# EAGLE design Skaarhoj BI8-2x4RGB (EAGLE 6.2)

## Sheet 1 of 2
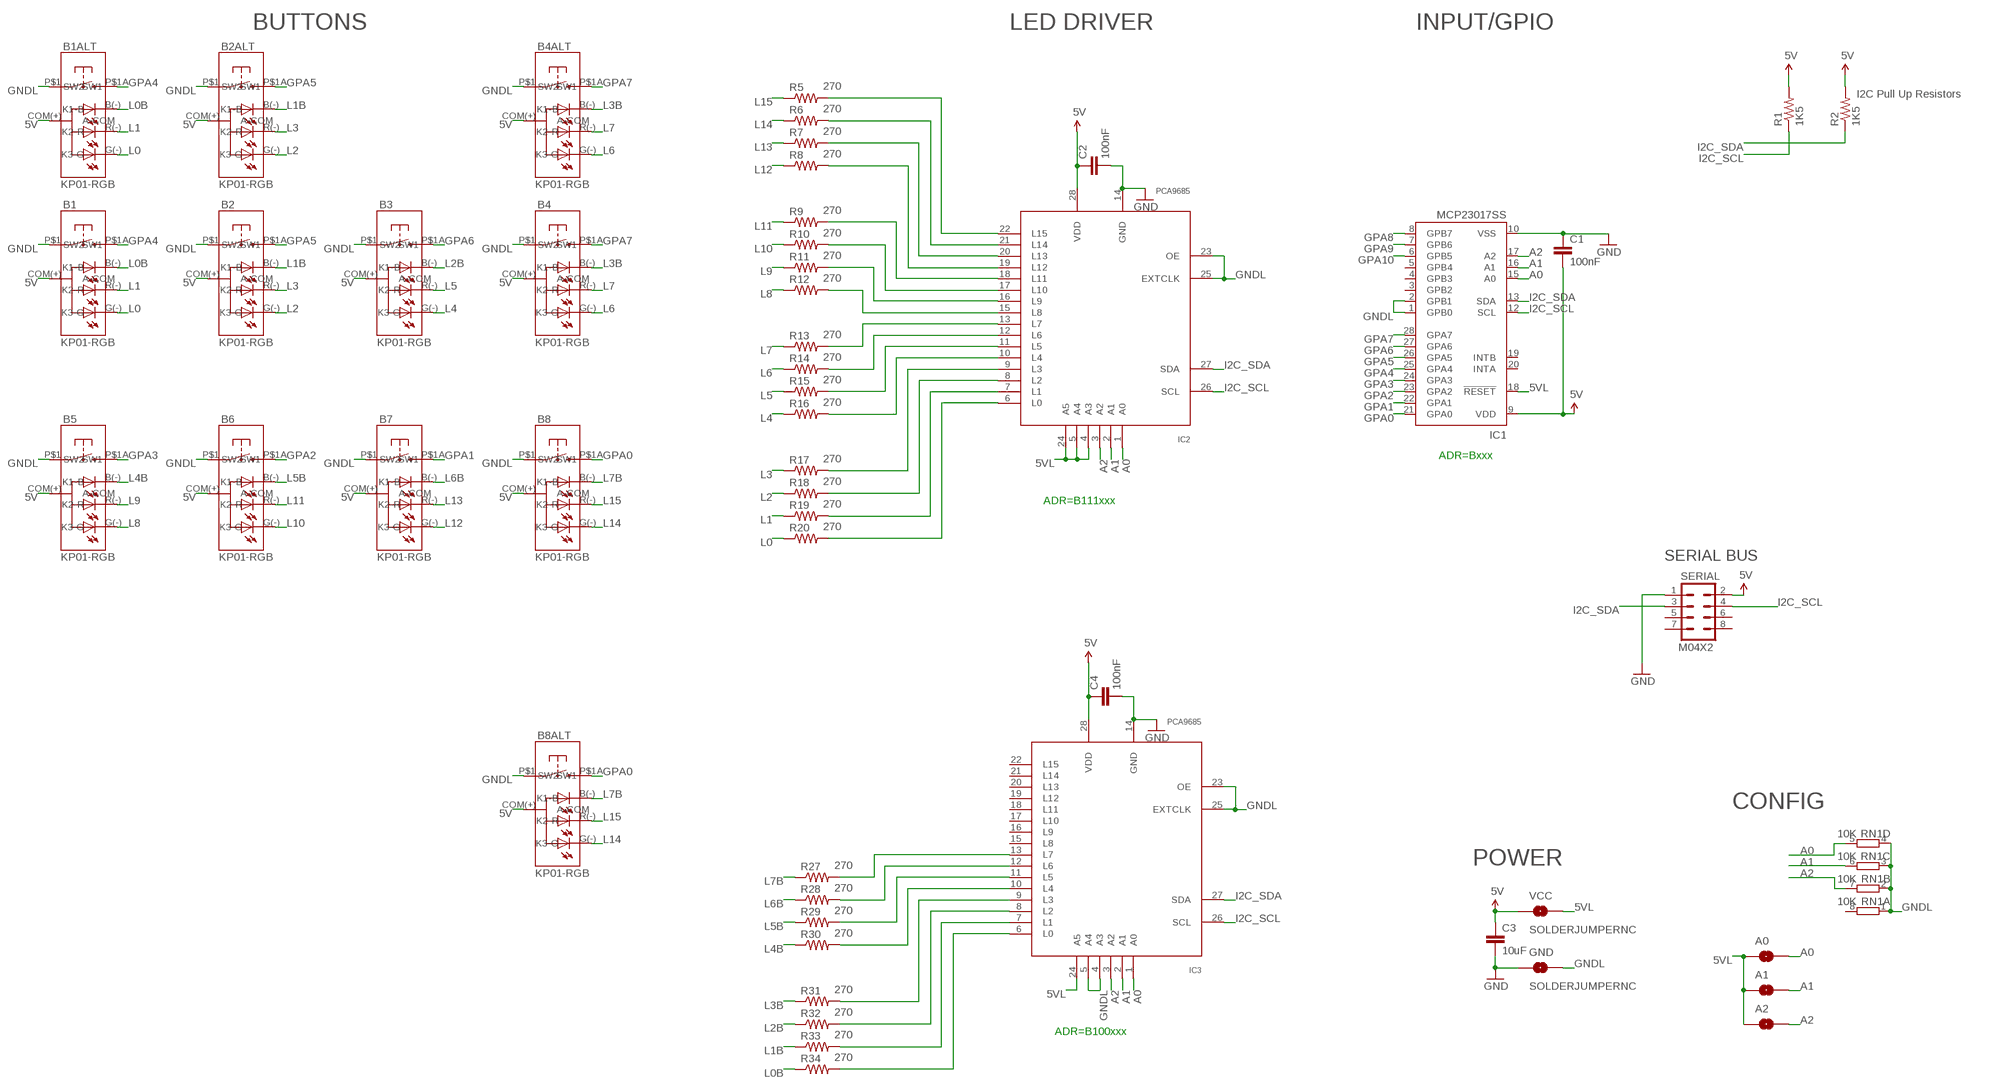
[diagram p0: schematic, sheet 1]

### Parts
A0  SOLDERJUMPERNC  [SJ_2S]
A1  SOLDERJUMPERNC  [SJ_2S]
A2  SOLDERJUMPERNC  [SJ_2S]
B1  KP01-RGB  NKK-KP01  [NKK-KP01]
B1ALT  KP01-RGB  NKK-KP01  [NKK-KP01]
B2  KP01-RGB  NKK-KP01  [NKK-KP01]
B2ALT  KP01-RGB  NKK-KP01  [NKK-KP01]
B3  KP01-RGB  NKK-KP01  [NKK-KP01]
B4  KP01-RGB  NKK-KP01  [NKK-KP01]
B4ALT  KP01-RGB  NKK-KP01  [NKK-KP01]
B5  KP01-RGB  NKK-KP01  [NKK-KP01]
B6  KP01-RGB  NKK-KP01  [NKK-KP01]
B7  KP01-RGB  NKK-KP01  [NKK-KP01]
B8  KP01-RGB  NKK-KP01  [NKK-KP01]
B8ALT  KP01-RGB  NKK-KP01  [NKK-KP01]
C1  100nF  CAP0603-CAP  [0603-CAP]
C2  100nF  CAP0603-CAP  [0603-CAP]
C3  10uF  CAP0805  [0805]
C4  100nF  CAP0603-CAP  [0603-CAP]
GND  SOLDERJUMPERNC  [SJ_2S]
IC1  MCP23017SS  [SSOP28]
IC2  PCA9685  [TSSOP28]
IC3  PCA9685  [TSSOP28]
R1  1K5  RESISTOR0603-RES  [0603-RES]
R2  1K5  RESISTOR0603-RES  [0603-RES]
R5  270  RESISTOR0603-RES  [0603-RES]
R6  270  RESISTOR0603-RES  [0603-RES]
R7  270  RESISTOR0603-RES  [0603-RES]
R8  270  RESISTOR0603-RES  [0603-RES]
R9  270  RESISTOR0603-RES  [0603-RES]
R10  270  RESISTOR0603-RES  [0603-RES]
R11  270  RESISTOR0603-RES  [0603-RES]
R12  270  RESISTOR0603-RES  [0603-RES]
R13  270  RESISTOR0603-RES  [0603-RES]
R14  270  RESISTOR0603-RES  [0603-RES]
R15  270  RESISTOR0603-RES  [0603-RES]
R16  270  RESISTOR0603-RES  [0603-RES]
R17  270  RESISTOR0603-RES  [0603-RES]
R18  270  RESISTOR0603-RES  [0603-RES]
R19  270  RESISTOR0603-RES  [0603-RES]
R20  270  RESISTOR0603-RES  [0603-RES]
R27  270  RESISTOR0603-RES  [0603-RES]
R28  270  RESISTOR0603-RES  [0603-RES]
R29  270  RESISTOR0603-RES  [0603-RES]
R30  270  RESISTOR0603-RES  [0603-RES]
R31  270  RESISTOR0603-RES  [0603-RES]
R32  270  RESISTOR0603-RES  [0603-RES]
R33  270  RESISTOR0603-RES  [0603-RES]
R34  270  RESISTOR0603-RES  [0603-RES]
RN1  10K  4R-NCAY16  [CAY16_HAND]
SERIAL  M04X2  [2X4]
VCC  SOLDERJUMPERNC  [SJ_2S]

### Nets
5V [Power]: B1.COM(+)(A-COM) B1ALT.COM(+)(A-COM) B2.COM(+)(A-COM) B2ALT.COM(+)(A-COM) B3.COM(+)(A-COM) B4.COM(+)(A-COM) B4ALT.COM(+)(A-COM) B5.COM(+)(A-COM) B6.COM(+)(A-COM) B7.COM(+)(A-COM) B8.COM(+)(A-COM) B8ALT.COM(+)(A-COM) C1.2 C2.1 C3.1 C4.1 IC1.9(VDD) IC2.28(VDD) IC3.28(VDD) R1.2 R2.2 SERIAL.2 VCC.1
5VL: A0.1 A1.1 A2.1 IC1.18(!RESET) IC2.4(A3) IC2.5(A4) IC2.24(A5) IC3.24(A5) VCC.2
A0: A0.2 IC1.15(A0) IC2.1(A0) IC3.1(A0) RN1.5
A1: A1.2 IC1.16(A1) IC2.2(A1) IC3.2(A1) RN1.6
A2: A2.2 IC1.17(A2) IC2.3(A2) IC3.3(A2) RN1.7
GND [Power]: C1.1 C2.2 C3.2 C4.2 GND.1 IC1.10(VSS) IC2.14(GND) IC3.14(GND) SERIAL.1
GNDL: B1.P$1(SW1) B1ALT.P$1(SW1) B2.P$1(SW1) B2ALT.P$1(SW1) B3.P$1(SW1) B4.P$1(SW1) B4ALT.P$1(SW1) B5.P$1(SW1) B6.P$1(SW1) B7.P$1(SW1) B8.P$1(SW1) B8ALT.P$1(SW1) GND.2 IC1.1(GPB0) IC1.2(GPB1) IC2.23(OE) IC2.25(EXTCLK) IC3.4(A3) IC3.5(A4) IC3.23(OE) IC3.25(EXTCLK) RN1.1 RN1.2 RN1.3 RN1.4
GPA0: B8.P$1A(SW2) B8ALT.P$1A(SW2) IC1.21(GPA0)
GPA1: B7.P$1A(SW2) IC1.22(GPA1)
GPA2: B6.P$1A(SW2) IC1.23(GPA2)
GPA3: B5.P$1A(SW2) IC1.24(GPA3)
GPA4: B1.P$1A(SW2) B1ALT.P$1A(SW2) IC1.25(GPA4)
GPA5: B2.P$1A(SW2) B2ALT.P$1A(SW2) IC1.26(GPA5)
GPA6: B3.P$1A(SW2) IC1.27(GPA6)
GPA7: B4.P$1A(SW2) B4ALT.P$1A(SW2) IC1.28(GPA7)
GPA8: IC1.8(GPB7)
GPA9: IC1.7(GPB6)
GPA10: IC1.6(GPB5)
I2C_SCL: IC1.12(SCL) IC2.26(SCL) IC3.26(SCL) R1.1 SERIAL.4
I2C_SDA: IC1.13(SDA) IC2.27(SDA) IC3.27(SDA) R2.1 SERIAL.3
L0: B1.G(-)(K3-G) B1ALT.G(-)(K3-G) R20.1
L0B: B1.B(-)(K1-B) B1ALT.B(-)(K1-B) R34.1
L1: B1.R(-)(K2-R) B1ALT.R(-)(K2-R) R19.1
L1B: B2.B(-)(K1-B) B2ALT.B(-)(K1-B) R33.1
L2: B2.G(-)(K3-G) B2ALT.G(-)(K3-G) R18.1
L2B: B3.B(-)(K1-B) R32.1
L3: B2.R(-)(K2-R) B2ALT.R(-)(K2-R) R17.1
L3B: B4.B(-)(K1-B) B4ALT.B(-)(K1-B) R31.1
L4: B3.G(-)(K3-G) R16.1
L4B: B5.B(-)(K1-B) R30.1
L5: B3.R(-)(K2-R) R15.1
L5B: B6.B(-)(K1-B) R29.1
L6: B4.G(-)(K3-G) B4ALT.G(-)(K3-G) R14.1
L6B: B7.B(-)(K1-B) R28.1
L7: B4.R(-)(K2-R) B4ALT.R(-)(K2-R) R13.1
L7B: B8.B(-)(K1-B) B8ALT.B(-)(K1-B) R27.1
L8: B5.G(-)(K3-G) R12.1
L9: B5.R(-)(K2-R) R11.1
L10: B6.G(-)(K3-G) R10.1
L11: B6.R(-)(K2-R) R9.1
L12: B7.G(-)(K3-G) R8.1
L13: B7.R(-)(K2-R) R7.1
L14: B8.G(-)(K3-G) B8ALT.G(-)(K3-G) R6.1
L15: B8.R(-)(K2-R) B8ALT.R(-)(K2-R) R5.1
N$2: IC3.13(L7) R27.2
N$3: IC3.12(L6) R28.2
N$4: IC2.13(L7) R13.2
N$5: IC2.12(L6) R14.2
N$6: IC3.11(L5) R29.2
N$7: IC2.11(L5) R15.2
N$9: IC2.10(L4) R16.2
N$10: IC2.9(L3) R17.2
N$11: IC2.8(L2) R18.2
N$12: IC2.7(L1) R19.2
N$13: IC3.10(L4) R30.2
N$14: IC3.9(L3) R31.2
N$15: IC3.8(L2) R32.2
N$16: IC3.7(L1) R33.2
N$17: IC3.6(L0) R34.2
N$19: IC2.6(L0) R20.2
N$20: IC2.15(L8) R12.2
N$21: IC2.16(L9) R11.2
N$22: IC2.17(L10) R10.2
N$23: IC2.18(L11) R9.2
N$24: IC2.19(L12) R8.2
N$25: IC2.20(L13) R7.2
N$26: IC2.21(L14) R6.2
N$27: IC2.22(L15) R5.2
Unconnected: IC1.3(GPB2) IC1.4(GPB3) IC1.5(GPB4) IC1.19(INTB) IC1.20(INTA) IC3.15(L8) IC3.16(L9) IC3.17(L10) IC3.18(L11) IC3.19(L12) IC3.20(L13) IC3.21(L14) IC3.22(L15) RN1.8 SERIAL.5 SERIAL.6 SERIAL.7 SERIAL.8

### Notes on the sheet
- BUTTONS | LED DRIVER | INPUT/GPIO
- I2C Pull Up Resistors
- ADR=Bxxx
- ADR=B111xxx
- SERIAL BUS
- CONFIG
- POWER
- ADR=B100xxx

## Sheet 2 of 2

## Library data of the parts
A0 A1 A2 GND VCC = SparkFun:SOLDERJUMPER: Solder Jumper Standard SMD solder jumper. Used to automate production. Two varients : Normally Open and Normally Closed are the same, but have different paste layers. NC will have a large amount of paste and should jumper during reflow.
B1 B1ALT B2 B2ALT B3 B4 B4ALT B5-B8 B8ALT = SKAARHOJ:NKK-KP01: NKK-KP01-15AC 100mA12VDC
C1-C4 = SparkFun:CAP: Capacitor Standard 0603 ceramic capacitor, and 0.1" leaded capacitor.
IC1 = microchip:MCP23017: http://ww1.microchip.com/downloads/en/DeviceDoc/21952a.pdf Source: http://ww1.microchip.com/downloads/en/DeviceDoc/21952a.pdf; MF: MICROCHIP; MPN: MCP23017-E/SS; OC_FARNELL: 1467674; OC_NEWARK: 31K2960
IC2 IC3 = wsmith:PCA9685
R1 R2 R5-R20 R27-R34 = SparkFun:RESISTOR: Resistor Basic schematic elements and footprints for 0603, 1206, and PTH resistors.
RN1 = SKAARHOJ:4R-N: Array Chip Resistor Source: RS Component / Phycomp; OC_FARNELL: unknown; OC_NEWARK: unknown
SERIAL = SparkFun:M04X2

## Net classes
0 default: width 0.152 mm, drill 0.254 mm, clearance 0.152 mm
1 Power: width 0.406 mm, drill 0.61 mm, clearance 0.203 mm

## Board
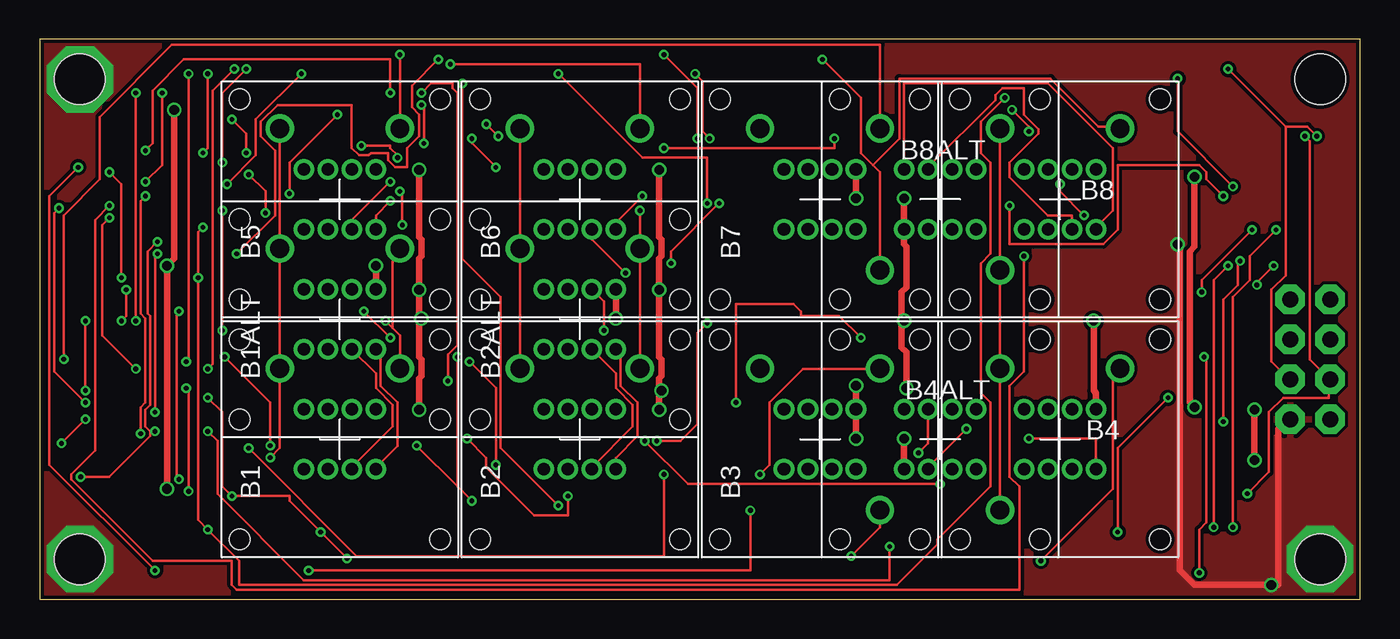
[diagram p1: board, top side]
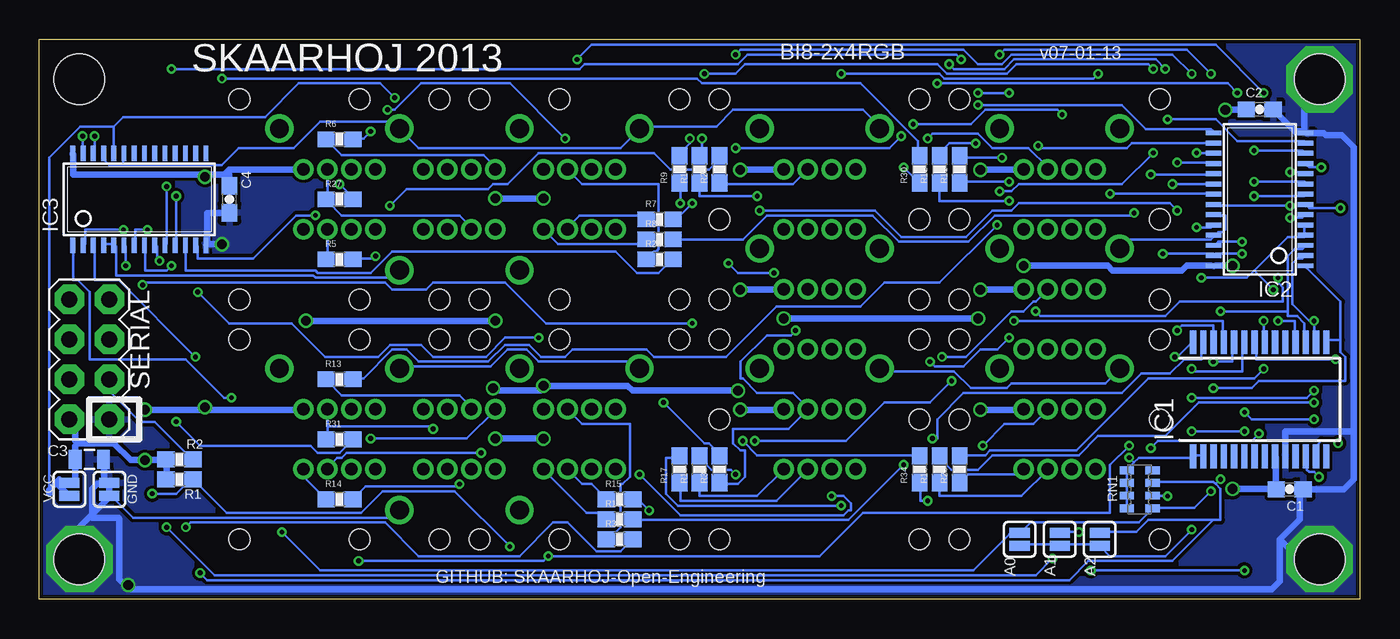
[diagram p2: board, bottom side, seen from below]

Size 83.82 x 35.56 mm. Coordinates in mm from the lower left corner, seen from the top.
Outline: 0,0 83.82,0 83.82,35.56 0,35.56 0,0
Copper layers (1*16): Top 0.035mm / dielectric 1.5mm / Bottom 0.035mm
Design rules: minimum track width 6mil, minimum drill 12mil, track to track 6mil, track to pad 6mil, pad to pad 6mil, via to via 6mil, smd to smd 0mil, copper to edge 10mil, drill to drill 10mil, minimum pad ring 10mil, minimum via ring 6mil, stop-mask expansion 2mil, vias tented up to drill 100mil, thermal gap 10mil
Holes 3.2 mm at 2.54,2.54 2.54,33.02 81.28,33.02 81.28,2.54

### Footprints (pad centres in the part's own frame; a part is rotated, then mirrored left to right if it is on the bottom)
SJ_2S = smd 0.635 x 1.27: 1 -0.412,0; 2 0.412,0
NKK-KP01 = drill 0.8: B(-) 1.905,-0.762; COM(+) 1.905,-2.286; G(-) -1.905,-2.286; P$3 1.905,0.762; P$4 1.905,2.286; P$7 -1.905,0.762; P$8 -1.905,2.286; R(-) -1.905,-0.762 | drill 1.2: P$1 4.496,3.81; P$1A 4.496,-3.81 | hole 1.3: -6.35,6.35; 6.35,6.35; 6.35,-6.35; -6.35,-6.35
0603-CAP = smd 1.1 x 1: 1 -0.85,0; 2 0.85,0
0805 = smd 0.8 x 1.2: 1 -0.9,0; 2 0.9,0
SSOP28 = smd 0.4 x 1.5: 1 -4.225,-3.625; 2 -3.575,-3.625; 3 -2.925,-3.625; 4 -2.275,-3.625; 5 -1.625,-3.625; 6 -0.975,-3.625; 7 -0.325,-3.625; 8 0.325,-3.625; 9 0.975,-3.625; 10 1.625,-3.625; 11 2.275,-3.625; 12 2.925,-3.625; 13 3.575,-3.625; 14 4.225,-3.625; 15 4.225,3.625; 16 3.575,3.625; 17 2.925,3.625; 18 2.275,3.625; 19 1.625,3.625; 20 0.975,3.625; 21 0.325,3.625; 22 -0.325,3.625; 23 -0.975,3.625; 24 -1.625,3.625; 25 -2.275,3.625; 26 -2.925,3.625; 27 -3.575,3.625; 28 -4.225,3.625
TSSOP28 = smd 0.305 x 0.991: 1 -4.225,-2.918; 2 -3.575,-2.918; 3 -2.925,-2.918; 4 -2.275,-2.918; 5 -1.625,-2.918; 6 -0.975,-2.918; 7 -0.325,-2.918; 8 0.325,-2.918; 9 0.975,-2.918; 10 1.625,-2.918; 11 2.275,-2.918; 12 2.925,-2.918; 13 3.575,-2.918; 14 4.225,-2.918; 15 4.225,2.918; 16 3.575,2.918; 17 2.925,2.918; 18 2.275,2.918; 19 1.625,2.918; 20 0.975,2.918; 21 0.325,2.918; 22 -0.325,2.918; 23 -0.975,2.918; 24 -1.625,2.918; 25 -2.275,2.918; 26 -2.925,2.918; 27 -3.575,2.918; 28 -4.225,2.918
0603-RES = smd 1.1 x 1: 1 -0.85,0; 2 0.85,0
CAY16_HAND = smd 0.5 x 0.904: 1 -1.2,-0.813; 2 -0.4,-0.813; 3 0.4,-0.813; 4 1.2,-0.813; 5 1.2,0.813; 6 0.4,0.813; 7 -0.4,0.813; 8 -1.2,0.813
2X4 = drill 1.016 pad 1.88 octagon: 1 -3.81,-1.27; 2 -3.81,1.27; 3 -1.27,-1.27; 4 -1.27,1.27; 5 1.27,-1.27; 6 1.27,1.27; 7 3.81,-1.27; 8 3.81,1.27

### Placement (x,y rotation side)
A0  21.59,3.81 90 bottom
A1  19.05,3.81 90 bottom
A2  16.51,3.81 90 bottom
B1  19.05,10.16 90 top
B1ALT  19.05,17.78 90 top
B2  34.29,10.16 90 top
B2ALT  34.29,17.78 90 top
B3  49.53,10.16 90 top
B4  64.77,10.16 90 top
B4ALT  57.15,10.16 270 top
B5  19.05,25.4 90 top
B6  34.29,25.4 90 top
B7  49.53,25.4 90 top
B8  64.77,25.4 90 top
B8ALT  57.15,25.4 270 top
C1  4.45,6.99 180 bottom
C2  6.35,31.11 0 bottom
C3  80.64,8.89 0 bottom
C4  71.75,25.4 270 bottom
GND  79.38,6.99 270 bottom
IC1  6.35,12.7 0 bottom
IC2  6.35,25.4 90 bottom
IC3  77.47,25.4 0 bottom
R1  74.93,7.62 180 bottom
R2  74.93,8.89 180 bottom
R5  64.77,21.59 0 bottom
R6  64.77,29.21 0 bottom
R7  44.45,24.13 0 bottom
R8  44.45,22.86 0 bottom
R9  43.18,27.3 90 bottom
R10  41.91,27.3 90 bottom
R11  25.4,27.3 90 bottom
R12  26.67,27.3 90 bottom
R13  64.77,13.97 0 bottom
R14  64.77,6.35 0 bottom
R15  46.99,6.35 0 bottom
R16  46.99,5.08 0 bottom
R17  43.18,8.26 90 bottom
R18  41.91,8.26 90 bottom
R19  26.67,8.26 90 bottom
R20  25.4,8.26 90 bottom
R27  64.77,25.4 0 bottom
R28  44.45,21.59 0 bottom
R29  40.64,27.3 90 bottom
R30  27.94,27.3 90 bottom
R31  64.77,10.16 0 bottom
R32  46.99,3.81 0 bottom
R33  40.64,8.26 90 bottom
R34  27.94,8.26 90 bottom
RN1  13.97,6.99 270 bottom
SERIAL  80.64,15.24 90 bottom
VCC  81.92,6.99 270 bottom

### Tracks (layer width: path | path; a pad name or v marks a point on that pad's centre or on a via)
5V  (via drill 0.61)
  Top 0.406: v24.08,12.04 24.08,14.02 24.23,14.17 24.23,15.24 24.08,15.39 24.08,17.83 | 24.08,17.83 v24.08,19.66 24.08,21.64 24.23,21.79 24.23,22.86 24.08,23.01 v24.08,27.28 | v8.53,31.09 8.53,21.64 v8.08,21.18 v8.08,7.01 | v21.34,21.18 B1ALT.COM(+) | v77.11,8.84 v77.11,12.04 | v73.3,26.82 73.3,22.4 73,22.1 73,12.5 v73.3,12.19 | v54.86,25.45 B8ALT.COM(+) 54.86,22.55 55.02,22.4 55.02,19.81 54.71,19.51 54.71,17.68 | B7.COM(+) v51.82,25.45 | v54.86,10.21 B4ALT.COM(+) | v51.82,10.21 B3.COM(+) v51.82,13.56 | 39.32,13.26 39.32,14.02 39.47,14.17 39.47,15.24 39.32,15.39 v39.32,19.66 39.32,21.64 39.47,21.79 39.47,22.86 39.32,23.01 v39.32,27.28 | 39.32,13.26 v39.32,12.04 | v39.47,13.26 39.32,13.26 | 54.71,17.68 54.71,16 55.02,15.7 v55.02,13.41 | B4.COM(+) 67.06,13.11 66.9,13.26 v66.9,17.68 | v54.86,17.68 54.71,17.68 | B2ALT.COM(+) v36.58,17.83 | v24.23,17.83 24.08,17.83
  Bottom 0.406: v24.08,12.04 21.34,12.04 B1.COM(+) | v24.08,19.66 21.34,19.66 B1ALT.COM(+) | v24.08,27.28 21.34,27.28 B5.COM(+) | IC1.9 5.33,8.99 5.33,7.01 C1.2 5.49,7.01 v8.08,7.01 | v8.08,21.18 9.14,21.18 IC2.28 9.45,21.18 10.97,21.18 11.28,20.88 15.7,20.88 16,21.18 v21.34,21.18 | v8.53,31.09 7.32,31.09 C2.1 | 71.93,26.98 71.78,26.98 71.78,26.36 C4.1 | 71.93,26.98 73.3,26.98 | 73.3,26.98 81.69,26.98 81.69,28.19 IC3.28 | B8.COM(+) 67.06,27.28 71.78,27.28 71.93,27.13 71.93,26.98 | R1.2 75.74,7.62 75.74,8.84 R2.2 75.89,8.84 v77.11,8.84 78.03,8.84 79.1,9.91 81.38,9.91 | VCC.1 81.84,7.47 81.53,7.47 81.53,8.84 C3.1 81.53,8.99 81.53,9.75 81.38,9.91 | v77.11,12.04 73.3,12.04 | 73.3,12.04 67.06,12.04 B4.COM(+) | SERIAL.2 81.84,11.43 81.53,11.12 81.53,10.06 81.38,10.06 81.38,9.91 | v73.3,26.82 73.3,26.98 | v73.3,12.19 73.3,12.04 | v51.82,25.45 v54.86,25.45 | v51.82,10.21 v54.86,10.21 | v39.32,12.04 36.58,12.04 B2.COM(+) | v39.32,19.66 36.58,19.66 B2ALT.COM(+) | v39.32,27.28 36.58,27.28 B6.COM(+) | v39.47,13.26 46.18,13.26 46.48,13.56 v51.82,13.56 51.82,13.41 51.97,13.26 54.86,13.26 v55.02,13.41 | v54.86,17.68 v66.9,17.68 | v36.58,17.83 v24.23,17.83
5VL  (via drill 0.3)
  Top 0.152: v10.36,23.62 10.06,23.32 v10.06,20.42 10.06,5.03 v10.67,4.42 12.65,2.44 12.65,0.91 54.41,0.91 57,3.5 57,3.81 60.35,7.16 60.35,12.5 59.74,13.11 59.74,21.34 60.35,21.95 60.35,27.74 59.74,28.35 59.74,30.33 v61.27,31.85 | v5.18,17.68 5.49,17.98 v5.49,19.66
  Bottom 0.152: 79.1,30.02 79.1,28.35 IC3.24 | 79.1,30.02 81.23,30.02 83.21,28.04 83.21,6.71 | 81.99,6.71 VCC.2 | 19.05,3.5 16.61,3.5 A2.1 16.46,3.35 15.85,2.74 12.34,2.74 v10.67,4.42 | 19.05,3.5 21.49,3.5 A0.1 | 19.05,3.5 A1.1 | IC2.5 3.5,23.77 3.5,23.16 IC2.4 3.5,23.01 4.57,23.01 6.71,20.88 | v10.36,23.62 9.45,23.62 9.3,23.77 IC2.24 | v10.06,20.42 7.16,20.42 6.71,20.88 | v5.18,17.68 4.12,17.68 4.12,16.46 IC1.18 | 6.71,20.88 v5.49,19.66 | 79.1,30.02 78.49,30.63 69.49,30.63 67.36,32.77 62.18,32.77 v61.27,31.85
  Bottom 0.406: 83.21,6.71 83.21,6.96 82.55,7.62 82.55,7.21 VCC.2
A0  (via drill 0.3)
  Top 0.152: v71.63,12.8 68.43,9.6 v68.43,4.27 | v9.3,13.41 9.45,13.26 v9.45,6.86
  Bottom 0.152: 1.22,16.46 1.22,18.9 3.35,21.03 IC2.1 | 1.22,16.46 1.98,16.46 IC1.15 | v71.63,12.8 72.08,12.8 74.52,15.24 80.62,15.24 80.62,19.51 81.38,20.27 81.69,20.27 81.69,22.4 IC3.1 | v68.43,4.27 65.99,1.83 24.54,1.83 22.25,4.12 21.64,4.12 A0.2 21.49,4.27 20.88,4.88 14.02,4.88 13.26,5.64 RN1.5 13.11,5.79 10.52,5.79 v9.45,6.86 | 1.22,16.46 1.22,15.7 0.91,15.39 0.91,13.87 6.4,13.87 6.86,13.41 v9.3,13.41
A1  (via drill 0.3)
  Top 0.152: v78.49,23.47 76.81,21.79 76.81,20.27 75.74,19.2 v75.74,4.57 | v19.51,2.59 v17.83,4.27 15.85,6.25 15.85,6.55 v12.19,6.55 11.58,7.16 11.58,11.89 v10.67,12.8 | v2.9,13.26 v2.9,17.68
  Bottom 0.152: 3.05,17.53 2.9,17.37 2.9,16.46 IC1.16 | 3.05,17.53 4.27,18.75 4.27,21.34 3.96,21.64 3.66,21.64 3.5,21.79 IC2.2 | v12.19,6.55 13.11,6.55 RN1.6 | v17.83,4.27 19.05,4.27 A1.2 | v78.49,23.47 80.92,23.47 80.92,22.55 IC3.2 | v75.74,4.57 72.69,1.52 20.57,1.52 v19.51,2.59 | v2.9,17.68 3.05,17.53 | v2.9,13.26 3.35,12.8 v10.67,12.8
A2  (via drill 0.3)
  Top 0.152: v73.91,15.39 74.07,15.24 74.07,4.88 73.61,4.42 v73.61,1.68 | v8.84,18.29 8.69,18.14 8.69,7.77 v8.84,7.62
  Bottom 0.152: 4.57,18.29 4.57,17.98 3.96,17.98 3.5,17.53 3.5,16.46 IC1.17 | 4.57,18.29 4.57,21.79 4.12,22.25 3.66,22.25 3.5,22.4 IC2.3 | 9.14,7.32 8.84,7.01 8.84,5.03 9.3,5.03 | 9.14,7.32 9.3,7.47 13.11,7.47 RN1.7 | 9.3,5.03 13.41,5.03 14.17,4.27 16.46,4.27 A2.2 | v73.91,15.39 78.79,20.27 80.31,20.27 80.31,22.4 IC3.3 | v73.61,1.68 73.15,1.22 18.44,1.22 17.22,2.44 11.89,2.44 9.3,5.03 | v8.84,18.29 4.57,18.29 | 9.14,7.32 v8.84,7.62
GND  (via drill 0.61, 3.2)
  Top 0.406: v72.24,22.55 72.39,22.4 72.39,1.83 73.3,0.91 v78.18,0.91 78.64,0.91 78.64,10.82 79.25,11.43 SERIAL.1
  Bottom 0.406: 5.08,3.81 3.81,5.08 3.81,6.99 C1.1 1.02,6.99 0.38,7.62 0.38,10.67 | 5.08,3.81 5.08,1.14 5.59,0.64 78.11,0.64 78.28,0.81 | 78.28,0.81 78.74,1.27 78.74,5.08 78.79,5.18 80.47,5.18 80.47,7.01 80.16,7.32 80.01,7.32 79.86,7.47 GND.1 | 0.38,10.67 0.38,28.7 1.14,29.46 2.16,29.46 2.29,29.59 3.4,29.59 IC2.14 3.5,29.72 | 73.15,22.55 73.15,24.54 71.78,24.54 C4.2 | 73.15,22.55 IC3.14 | v72.24,22.55 73.15,22.55 | C3.2 79.7,8.84 79.7,7.47 79.4,7.47 GND.1 | 3.5,29.72 4.12,29.72 5.49,31.09 C2.2 | 0.38,10.67 4.72,10.67 4.72,9.14 IC1.10 | v78.18,0.91 78.28,0.81 | 3.5,29.72 3.5,32.05 v2.54,33.02 | v2.54,2.54 3.81,2.54 5.08,3.81 | v81.28,2.54 81.28,4.57 79.38,6.48 GND.1
  pour Top: 0,0 83.82,0 83.82,35.56 0,35.56
  pour Bottom: 0,0 0,35.56 83.82,35.56 83.82,0
GNDL  (via drill 0.3)
  Top 0.152: B4ALT.P$1 B4.P$1 B8ALT.P$1 B8.P$1 | B5.P$1 B1ALT.P$1 B1.P$1 15.24,9.6 v14.63,8.99 | B2.P$1 B2ALT.P$1 B6.P$1
  Bottom 0.152: GND.2 79.25,6.55 77.88,5.18 61.42,5.18 60.96,5.64 B4ALT.P$1 | B3.P$1 45.72,14.78 46.02,15.09 52.12,15.09 52.88,15.85 54.1,15.85 55.17,14.78 60.96,14.78 B4.P$1 | IC3.4 79.7,22.55 79.1,22.55 IC3.5 78.94,22.4 78.94,20.57 66.45,20.57 66.29,20.42 61.42,20.42 60.96,20.88 B8ALT.P$1 | RN1.4 RN1.3 RN1.2 RN1.1 14.78,8.23 14.33,8.69 | IC1.2 10.06,9.14 10.52,9.14 IC1.1 10.67,8.99 14.02,8.99 14.33,8.69 | IC2.23 9.14,24.38 8.53,24.38 8.53,23.47 8.69,23.32 8.99,23.32 9.14,23.16 IC2.25 9.3,23.01 9.45,22.86 14.78,22.86 15.24,22.4 B1ALT.P$1 | v14.63,8.99 14.33,8.69 | 78.49,27.58 78.49,28.19 IC3.23 | 78.49,27.58 79.4,27.58 79.7,27.89 79.7,28.19 IC3.25 | 78.49,27.58 72.24,27.58 71.17,28.65 67.67,28.65 65.99,30.33 61.27,30.33 60.96,30.02 B8.P$1 60.96,29.87 59.74,28.65 46.94,28.65 45.72,29.87 B7.P$1 45.72,30.02 40.84,30.02 39.78,31.09 31.55,31.09 30.48,30.02 B6.P$1 | B1.P$1 15.24,14.63 16.15,13.72 22.1,13.72 22.4,13.41 24.69,13.41 25.76,14.48 30.33,14.48 30.48,14.63 B2.P$1
GPA0  (via drill 0.3)
  Top 0.152: v6.1,32.16 v6.1,17.68 | v49.68,34.29 52.12,31.85 52.12,28.35 52.88,27.58 | 52.88,27.58 53.34,27.13 B8ALT.P$1A | 52.88,27.58 54.56,29.26 54.56,33.07 64.16,33.07 67.21,30.02 68.58,30.02 B8.P$1A
  Bottom 0.152: v6.1,17.68 6.1,16.46 IC1.21 | v6.1,32.16 9.14,35.2 48.77,35.2 v49.68,34.29
GPA1  (via drill 0.3)
  Top 0.152: v1.52,15.24 1.52,24.38 3.81,26.67 3.81,30.63 8.38,35.2 53.34,35.2 B7.P$1A
  Bottom 0.152: v1.52,15.24 6.55,15.24 6.55,16.31 IC1.22
GPA2  (via drill 0.3)
  Top 0.152: v10.67,14.63 10.97,14.94 10.97,32.31 v12.34,33.68 | v26.06,33.98 38.1,33.98 B6.P$1A
  Bottom 0.152: v10.67,14.63 10.52,14.48 7.47,14.48 7.47,16.31 IC1.23 | v12.34,33.68 12.95,34.29 21.95,34.29 22.55,33.68 25.76,33.68 v26.06,33.98
GPA3  (via drill 0.3)
  Top 0.152: v9.3,15.09 9.45,15.24 v9.45,33.38 | B5.P$1A v22.86,34.59
  Bottom 0.152: v9.3,15.09 8.08,15.09 8.08,16.31 IC1.24 | v9.45,33.38 10.97,34.9 22.55,34.9 v22.86,34.59
GPA4  (via drill 0.3)
  Top 0.152: 22.4,17.22 22.86,16.76 B1.P$1A | 22.4,17.22 v21.95,17.68 | 22.4,17.22 22.4,21.79 22.86,22.25 B1ALT.P$1A
  Bottom 0.152: v21.95,17.68 8.69,17.68 8.69,16.46 IC1.25
GPA5  (via drill 0.3)
  Top 0.152: v11.58,24.69 v11.58,17.07 | v38.1,24.69 B2ALT.P$1A B2.P$1A
  Bottom 0.152: v11.58,17.07 11.28,17.37 9.3,17.37 9.3,16.46 IC1.26 | v11.58,24.69 12.04,25.15 21.64,25.15 22.1,24.69 23.32,24.69 24.99,23.01 29.11,23.01 30.79,24.69 v38.1,24.69
GPA6  (via drill 0.3)
  Top 0.152: v27.13,10.21 28.35,8.99 28.35,8.38 31.39,5.33 33.53,5.33 v33.53,6.55 | v45.72,7.92 46.33,8.53 46.33,12.5 48.46,14.63 53.34,14.63 B3.P$1A
  Bottom 0.152: v27.13,10.21 26.82,10.21 26.82,11.43 25.15,13.11 15.09,13.11 13.87,14.33 12.04,14.33 11.12,15.24 10.06,15.24 10.06,16.31 IC1.27 | v33.53,6.55 32.77,6.55 32.31,6.1 32.31,5.64 32.46,5.64 32.77,5.33 43.13,5.33 v45.72,7.92
GPA7  (via drill 0.3)
  Top 0.152: v11.73,15.39 14.63,12.5 v14.63,9.75 | v51.51,2.74 53.34,4.57 B4ALT.P$1A | v63.55,2.44 68.12,7.01 68.12,14.17 68.58,14.63 B4.P$1A
  Bottom 0.152: v11.73,15.39 11.58,15.39 10.67,16.31 IC1.28 | v14.63,9.75 15.85,8.53 15.85,5.49 31.55,5.49 34.29,2.74 v51.51,2.74 51.82,2.44 v63.55,2.44
I2C_SCL  (via drill 0.3)
  Top 0.152: v7.47,22.71 6.86,22.1 6.86,18.14 7.01,17.98 7.01,12.34 6.71,12.04 6.71,10.97 7.01,10.67 | 7.01,10.67 7.01,10.36 4.42,7.77 v2.59,7.77 | v80.31,29.41 80.62,29.11 80.62,15.24 81.84,14.02 SERIAL.4 81.84,13.87 81.84,12.8 78.94,12.8 78.03,11.89 78.03,8.08 v76.66,6.71 | v7.32,10.67 7.01,10.67 | v10.67,10.67 11.28,10.06 11.28,6.71 16.76,1.22 53.95,1.22 v53.95,3.35
  Bottom 0.152: v7.47,22.71 8.99,22.71 9.14,22.55 IC2.26 | v2.59,7.77 2.9,8.08 3.2,8.08 3.35,8.23 3.35,8.99 IC1.12 | v80.31,29.41 80.31,28.35 IC3.26 | v76.66,6.71 75.13,6.71 74.22,7.62 R1.1 74.07,7.62 71.93,5.49 63.4,5.49 62.03,6.86 57.45,6.86 v53.95,3.35 | v10.67,10.67 v7.32,10.67
I2C_SDA  (via drill 0.3)
  Top 0.152: v7.47,21.95 7.32,21.79 v7.32,11.89 | v1.37,9.91 v2.9,11.43 | v81.08,29.41 80.47,30.02 79.1,30.02 | 79.1,30.02 79.1,20.57 78.18,19.66 78.18,15.09 79.25,14.02 SERIAL.3 | v12.5,21.95 14.94,24.38 14.94,28.5 14.02,29.41 14.02,30.33 15.09,31.39 19.81,31.39 19.81,28.65 20.27,28.19 20.88,28.19 21.03,28.35 22.1,28.35 22.1,27.89 22.55,27.43 23.32,27.43 23.32,28.65 24.08,29.41 24.08,30.79 23.62,31.24 23.62,32.61 v25.3,34.29 | 79.1,30.02 v75.44,33.68
  Bottom 0.152: v7.47,21.95 9.14,21.95 IC2.27 9.3,21.95 v12.5,21.95 | v7.32,11.89 6.86,11.43 v2.9,11.43 | v1.37,9.91 1.52,10.06 2.44,10.06 2.74,9.75 2.74,9.14 IC1.13 | v81.08,29.41 81.08,28.35 IC3.27 | R2.1 74.22,8.99 76.5,11.28 77.42,11.28 79.25,13.11 79.25,13.87 SERIAL.3 | v25.3,34.29 25.6,34.59 38.86,34.59 39.47,33.98 49.23,33.98 49.53,33.68 v75.44,33.68
L0
  Top 0.152: B1ALT.G(-) 21.34,15.85 21.64,15.54 21.64,13.56 22.71,12.5 22.71,9.75 21.34,8.38 B1.G(-)
  Bottom 0.152: R20.1 25.3,7.47 24.84,7.92 21.64,7.92 21.34,8.23 B1.G(-)
L0B  (via drill 0.3)
  Top 0.152: v23.93,9.75 26.52,7.16 | 26.52,7.16 v27.43,6.25 | 26.52,7.16 v26.52,15.39
  Bottom 0.152: v27.43,6.25 27.89,6.25 27.89,7.32 R34.1 | v23.93,9.75 22.55,11.12 20.73,11.12 19.81,12.04 B1.B(-) | v26.52,15.39 24.99,15.39 22.1,18.29 21.34,18.29 20.73,18.9 20.57,18.9 19.81,19.66 B1ALT.B(-)
L1
  Top 0.152: B1ALT.R(-) 19.81,15.85 21.34,14.33 21.34,13.41 22.4,12.34 22.4,10.97 19.81,8.38 B1.R(-)
  Bottom 0.152: R19.1 26.67,6.55 21.49,6.55 19.81,8.23 B1.R(-)
L1B  (via drill 0.3)
  Top 0.152: v35.81,17.07 35.81,18.9 35.05,19.66 B2ALT.B(-)
  Bottom 0.152: R33.1 40.54,7.32 39.47,7.32 39.01,7.77 39.01,9.45 39.32,9.45 39.78,9.91 39.78,10.82 36.27,10.82 35.05,12.04 B2.B(-) 35.05,12.19 35.97,13.11 38.25,13.11 39.17,14.02 39.32,14.02 39.32,15.09 37.64,16.76 36.12,16.76 v35.81,17.07
L2
  Top 0.152: B2.G(-) 36.58,8.99 37.95,10.36 37.95,12.5 36.88,13.56 36.88,15.54 36.58,15.85 B2ALT.G(-)
  Bottom 0.152: R18.1 41.91,6.55 38.25,6.55 36.58,8.23 B2.G(-)
L2B
  Bottom 0.152: R32.1 47.7,3.81 46.94,4.57 46.94,7.32 46.79,7.32 46.33,7.77 46.33,11.12 49.38,11.12 50.29,12.04 B3.B(-)
L3
  Top 0.152: B2ALT.R(-) 35.05,15.85 36.58,14.33 36.58,13.41 37.64,12.34 37.64,10.97 35.05,8.38 B2.R(-)
  Bottom 0.152: R17.1 43.13,7.32 43.13,6.25 37.03,6.25 35.05,8.23 B2.R(-)
L3B  (via drill 0.3)
  Top 0.152: v58.83,10.82 56.39,8.38 B4ALT.B(-)
  Bottom 0.152: B4.B(-) 65.53,10.97 | 65.53,10.97 65.53,10.21 R31.1 | v58.83,10.82 58.98,10.97 65.53,10.97
L4
  Bottom 0.152: R16.1 47.85,5.18 48.16,5.49 49.07,5.49 51.82,8.23 B3.G(-)
L4B  (via drill 0.3)
  Top 0.152: v28.96,27.43 27.43,28.96 v27.43,29.26
  Bottom 0.152: v28.96,27.43 28.04,26.52 R30.1 | v27.43,29.26 27.13,29.57 24.23,29.57 23.32,28.65 21.03,28.65 19.81,27.43 B5.B(-)
L5
  Bottom 0.152: R15.1 47.85,6.4 48.77,7.32 49.38,7.32 50.29,8.23 B3.R(-)
L5B
  Bottom 0.152: R29.1 40.54,26.36 35.97,26.36 35.05,27.28 B6.B(-)
L6  (via drill 0.3)
  Top 0.152: v62.79,10.21 67.06,10.21 B4.G(-)
  Bottom 0.152: B4.G(-) 67.06,7.77 65.68,6.4 R14.1 | v62.79,10.21 56.69,10.21 54.86,12.04 B4ALT.G(-)
L6B
  Bottom 0.152: R28.1 45.26,21.64 44.81,22.1 44.65,22.1 44.5,22.25 44.5,26.36 49.38,26.36 50.29,27.28 B7.B(-)
L7  (via drill 0.3)
  Top 0.152: v55.78,9.3 56.39,9.91 B4ALT.R(-)
  Bottom 0.152: R13.1 65.53,13.87 64.62,12.95 57.15,12.95 56.39,12.19 B4ALT.R(-) | v55.78,9.3 64.31,9.3 64.62,8.99 64.92,8.99 65.53,8.38 B4.R(-)
L7B
  Bottom 0.152: B8.B(-) 65.53,25.45 R27.1 65.53,25.3 64.62,24.38 57.15,24.38 56.39,23.62 B8ALT.B(-)
L8  (via drill 0.3)
  Top 0.152: v22.25,25.3 21.34,24.38 B5.G(-)
  Bottom 0.152: R12.1 26.67,25.3 v22.25,25.3
L9  (via drill 0.3)
  Top 0.152: v22.25,26.52 19.81,24.08 B5.R(-)
  Bottom 0.152: v22.25,26.52 25.3,26.52 R11.1
L10  (via drill 0.3)
  Top 0.152: v38.25,25.6 36.58,23.93 B6.G(-)
  Bottom 0.152: R10.1 41.91,25.6 v38.25,25.6
L11  (via drill 0.3)
  Top 0.152: v43.13,25.15 40.08,22.1 v40.08,21.34 | v37.19,20.73 35.05,22.86 B6.R(-)
  Bottom 0.152: v43.13,25.15 43.13,26.36 R9.1 | v40.08,21.34 39.47,20.73 v37.19,20.73
L12
  Bottom 0.152: R8.1 45.41,22.86 45.72,22.55 50.9,22.55 51.82,23.47 B7.G(-)
L13
  Bottom 0.152: R7.1 45.41,24.23 45.57,24.38 49.53,24.38 50.29,23.62 B7.R(-)
L14
  Top 0.152: B8ALT.G(-) 54.86,32.77 64.01,32.77 68.12,28.65 68.12,24.69 67.06,23.62 B8.G(-)
  Bottom 0.152: R6.1 65.53,29.11 64.62,28.19 55.63,28.19 54.86,27.43 B8ALT.G(-)
L15
  Top 0.152: B8.R(-) 65.53,24.38 64.01,24.38 61.57,26.82 61.57,27.74 63.4,29.57 63.4,29.87 62.48,30.79 62.48,32.46 61.11,32.46 60.66,32 60.66,31.7 56.39,27.43 B8ALT.R(-)
  Bottom 0.152: B8.R(-) 65.53,21.64 R5.1
N$2  (via drill 0.3)
  Top 0.152: v66.29,24.38 64.77,25.91 v64.77,26.36
  Bottom 0.152: v66.29,24.38 67.51,24.38 70.26,21.64 73.76,21.64 73.76,22.4 IC3.13 | v64.77,26.36 63.86,25.45 R27.2
N$3
  Bottom 0.152: IC3.12 74.52,22.4 74.52,20.88 66.29,20.88 66.14,20.73 62.79,20.73 61.42,22.1 47.24,22.1 45.87,20.73 44.5,20.73 43.74,21.49 R28.2
N$4  (via drill 0.3)
  Top 0.152: v12.19,30.48 13.11,29.57 v13.11,28.35 | v22.86,25.91 23.01,25.76 v23.01,23.77
  Bottom 0.152: v12.19,30.48 9.14,30.48 7.77,29.11 3.5,29.11 IC2.13 | v13.11,28.35 15.09,26.36 21.64,26.36 22.1,25.91 v22.86,25.91 | v23.01,23.77 26.67,20.12 30.18,20.12 31.7,18.59 37.03,18.59 40.23,15.39 44.81,15.39 45.26,15.85 49.99,15.85 50.44,15.39 51.97,15.39 52.73,16.15 54.25,16.15 55.32,15.09 59.74,15.09 60.5,15.85 61.42,15.85 63.25,14.02 63.86,14.02 R13.2
N$5  (via drill 0.3)
  Top 0.152: v6.71,28.5 7.16,28.96 7.16,32.31 9.14,34.29 22.25,34.29 v22.25,32.16 | v24.23,32.16 24.84,32.77 26.21,32.77 26.21,32.46 26.52,32.16 26.52,16.15 25.91,15.54 v25.91,13.87 | v38.41,10.06 41.15,7.32 v57.15,7.32
  Bottom 0.152: v6.71,28.5 3.66,28.5 3.5,28.35 IC2.12 | v24.23,32.16 v22.25,32.16 | v25.91,13.87 27.28,12.5 30.18,12.5 32.61,10.06 v38.41,10.06 | v57.15,7.32 57.3,7.16 63.09,7.16 63.86,6.4 R14.2
N$6  (via drill 0.3)
  Top 0.152: v75.13,25.6 74.07,26.67 74.07,27.13 73.61,27.58 68.43,27.58 68.43,23.47 67.51,22.55 61.57,22.55 v61.57,24.99
  Bottom 0.152: v75.13,25.6 75.13,22.55 IC3.11 | v61.57,24.99 60.5,26.06 55.32,26.06 55.02,26.36 54.1,26.36 52.12,28.35 44.81,28.35 43.74,27.28 41.3,27.28 40.54,28.04 R29.2
N$7  (via drill 0.3)
  Top 0.152: v2.44,27.43 0.61,25.6 0.61,8.53 v7.32,1.83 | v17.07,1.83 45.11,1.83 v45.11,5.64
  Bottom 0.152: v2.44,27.43 3.2,27.43 3.35,27.58 IC2.11 | v17.07,1.83 v7.32,1.83 | v45.11,5.64 45.72,6.25 46.02,6.25 R15.2
N$9  (via drill 0.3)
  Top 0.152: v4.42,27.13 5.18,26.36 v5.18,20.42 | v22.25,16.61 v20.57,18.29 | v27.28,15.09 28.96,13.41 v28.96,8.53
  Bottom 0.152: v4.42,27.13 3.5,27.13 IC2.10 | v5.18,20.42 5.18,20.12 4.88,19.81 4.88,18.9 11.43,18.9 12.34,17.98 20.27,17.98 v20.57,18.29 | v22.25,16.61 23.01,15.85 24.08,15.85 25.15,14.78 26.98,14.78 v27.28,15.09 | v28.96,8.53 32.46,5.03 46.02,5.03 R16.2
N$10  (via drill 0.3)
  Top 0.152: v6.71,26.52 7.77,27.58 v7.77,32.16 | v26.82,32.77 26.82,21.64 29.26,19.2 29.26,9.6 v32.92,5.94
  Bottom 0.152: v6.71,26.52 3.5,26.52 IC2.9 | v7.77,32.16 8.38,32.77 v26.82,32.77 | v32.92,5.94 43.28,5.94 44.04,6.71 44.04,8.99 43.28,8.99 R17.2
N$11  (via drill 0.3)
  Top 0.152: v6.71,25.6 6.4,25.3 6.4,18.14 6.71,17.83 6.71,12.5 6.4,12.19 v6.4,10.52 | v13.26,9.6 20.12,2.74 39.62,2.74 v39.62,7.92
  Bottom 0.152: v6.71,25.6 3.5,25.6 IC2.8 | v6.4,10.52 6.86,10.06 12.8,10.06 v13.26,9.6 | v39.62,7.92 39.93,8.23 41.15,8.23 41.91,8.99 R18.2
N$12  (via drill 0.3)
  Top 0.152: v1.22,24.84 0.91,24.54 0.91,14.48 v2.9,12.5
  Bottom 0.152: v1.22,24.84 3.2,24.84 3.35,24.99 IC2.7 | v2.9,12.5 10.21,12.5 12.34,10.36 16.61,10.36 17.83,9.14 23.32,9.14 24.23,8.23 25.91,8.23 26.67,8.99 R19.2
N$13  (via drill 0.3)
  Top 0.152: v75.74,26.21 72.24,29.72 v72.24,33.07
  Bottom 0.152: v75.74,26.21 75.74,22.55 IC3.10 | v72.24,33.07 42.06,33.07 41.76,32.77 31.7,32.77 28.04,29.11 28.04,28.19 R30.2
N$14  (via drill 0.3)
  Top 0.152: v76.2,21.49 76.05,21.34 76.05,19.96 75.13,19.05 v75.13,11.28
  Bottom 0.152: v76.2,21.49 76.35,21.49 76.35,22.4 IC3.9 | v75.13,11.28 73.61,9.75 66.6,9.75 66.14,9.3 64.77,9.3 64.01,10.06 R31.2
N$15  (via drill 0.3)
  Top 0.152: v75.44,21.18 74.52,20.27 v74.52,4.57
  Bottom 0.152: v75.44,21.18 75.74,20.88 77.11,20.88 77.11,22.4 IC3.8 | v74.52,4.57 74.22,4.88 61.87,4.88 59.74,2.74 53.34,2.74 51.21,4.88 50.29,4.88 48.46,3.05 46.94,3.05 46.18,3.81 R32.2
N$16  (via drill 0.3)
  Top 0.152: v76.96,23.47 73.76,20.27 v73.76,19.51 | v52.12,16.61 50.75,17.98 48.31,17.98 48.31,18.29 47.85,18.75 44.2,18.75 v44.2,12.5
  Bottom 0.152: v76.96,23.47 77.72,23.47 77.72,22.55 IC3.7 | v73.76,19.51 71.78,17.53 67.82,17.53 65.68,15.39 62.33,15.39 61.57,16.15 59.59,16.15 58.83,15.39 55.47,15.39 54.25,16.61 v52.12,16.61 | v44.2,12.5 41.6,9.91 41.3,9.91 40.54,9.14 R33.2
N$17  (via drill 0.3)
  Top 0.152: v78.33,21.18 77.27,20.12 v77.27,19.96 | v42.37,17.53 41.76,16.92 41.76,11.12 40.69,10.06 v39.17,10.06
  Bottom 0.152: v78.33,21.18 78.33,22.4 IC3.6 | v77.27,19.96 77.11,20.12 61.87,20.12 61.42,19.66 59.28,19.66 58.83,20.12 54.25,20.12 51.66,17.53 v42.37,17.53 | v39.17,10.06 38.25,9.14 28.04,9.14 R34.2
N$19  (via drill 0.3)
  Top 0.152: v4.42,24.23 3.96,23.77 3.96,16.76 v6.1,14.63
  Bottom 0.152: v4.42,24.23 3.66,24.23 3.5,24.38 IC2.6 | v6.1,14.63 6.71,14.02 13.41,14.02 17.98,9.45 23.47,9.45 23.77,9.14 25.3,9.14 R20.2
N$20  (via drill 0.3)
  Top 0.152: v24.23,31.39 24.38,31.24 v24.38,28.96
  Bottom 0.152: v24.23,31.39 15.09,31.39 13.56,29.87 9.45,29.87 9.3,29.72 IC2.15 | v24.38,28.96 26.06,28.96 26.67,28.35 R12.2
N$21  (via drill 0.3)
  Top 0.152: v20.42,28.8 22.25,28.8 22.25,28.65 22.71,28.19 v22.71,28.04
  Bottom 0.152: v20.42,28.8 20.27,28.65 14.78,28.65 14.48,28.96 9.3,28.96 IC2.16 | v22.71,28.04 25.3,28.04 R11.2
N$22  (via drill 0.3)
  Top 0.152: v10.36,28.35 10.67,28.65 v10.67,33.38 | v39.62,34.59 41.76,32.46 v41.76,29.26
  Bottom 0.152: v10.36,28.35 9.3,28.35 IC2.17 | v10.67,33.38 11.89,34.59 22.1,34.59 22.71,33.98 24.23,33.98 25.15,34.9 39.32,34.9 v39.62,34.59 | v41.76,29.26 41.76,28.19 41.91,28.19 R10.2
N$23  (via drill 0.3)
  Top 0.152: v11.58,27.74 11.58,32.16 v13.11,33.68 | v41.6,33.38 42.06,32.92 42.06,29.72 v42.52,29.26
  Bottom 0.152: v11.58,27.74 9.3,27.74 IC2.18 | v13.11,33.68 13.41,33.98 21.79,33.98 22.4,33.38 26.21,33.38 26.82,33.98 39.01,33.98 39.62,33.38 v41.6,33.38 | v42.52,29.26 42.52,28.96 43.28,28.19 R9.2
N$24  (via drill 0.3)
  Top 0.152: v13.26,26.98 14.33,25.91 v14.33,24.54
  Bottom 0.152: v13.26,26.98 9.3,26.98 IC2.19 | v14.33,24.54 14.48,24.38 23.16,24.38 24.84,22.71 29.26,22.71 30.94,24.38 37.64,24.38 39.17,22.86 R8.2
N$25  (via drill 0.3)
  Top 0.152: v11.89,26.36 13.72,28.19 13.72,30.48 v16.61,33.38 | v32.92,33.38 38.25,28.04 42.37,28.04 v42.37,25.15
  Bottom 0.152: v11.89,26.36 9.3,26.36 IC2.20 | v16.61,33.38 16.92,33.07 26.36,33.07 26.67,33.38 v32.92,33.38 | v42.37,25.15 43.28,24.23 43.59,24.23 R7.2
N$26  (via drill 0.3)
  Top 0.152: v15.85,25.76 15.85,27.74 v18.9,30.79 | v29.11,29.41 v28.35,30.18 | v39.62,28.65 50.44,28.65 v50.44,29.26 | v61.72,31.09 62.79,30.02 v62.79,29.72
  Bottom 0.152: v15.85,25.76 9.3,25.76 IC2.21 | v18.9,30.79 19.2,31.09 23.77,31.09 24.69,30.18 v28.35,30.18 | v29.11,29.41 29.87,28.65 v39.62,28.65 | v50.44,29.26 53.95,32.77 59.59,32.77 61.27,31.09 v61.72,31.09 | v62.79,29.72 63.25,29.26 63.86,29.26 R6.2
N$27  (via drill 0.3)
  Top 0.152: v4.42,24.99 3.5,24.08 3.5,9.45 1.98,7.92 1.98,7.62 7.16,2.44 12.19,2.44 12.19,0.91 12.5,0.61 62.18,0.61 62.18,7.16 61.57,7.77 61.57,13.56 62.48,14.48 v62.48,21.79
  Bottom 0.152: v4.42,24.99 9.14,24.99 IC2.22 | v62.48,21.79 62.64,21.64 63.86,21.64 R5.2

### Text on the board
_bsilk: v07-01-13 | BI8-2x4RGB | SKAARHOJ 2013 | GITHUB: SKAARHOJ-Open-Engineering